# EAGLE design robot (EAGLE 6.5.0)
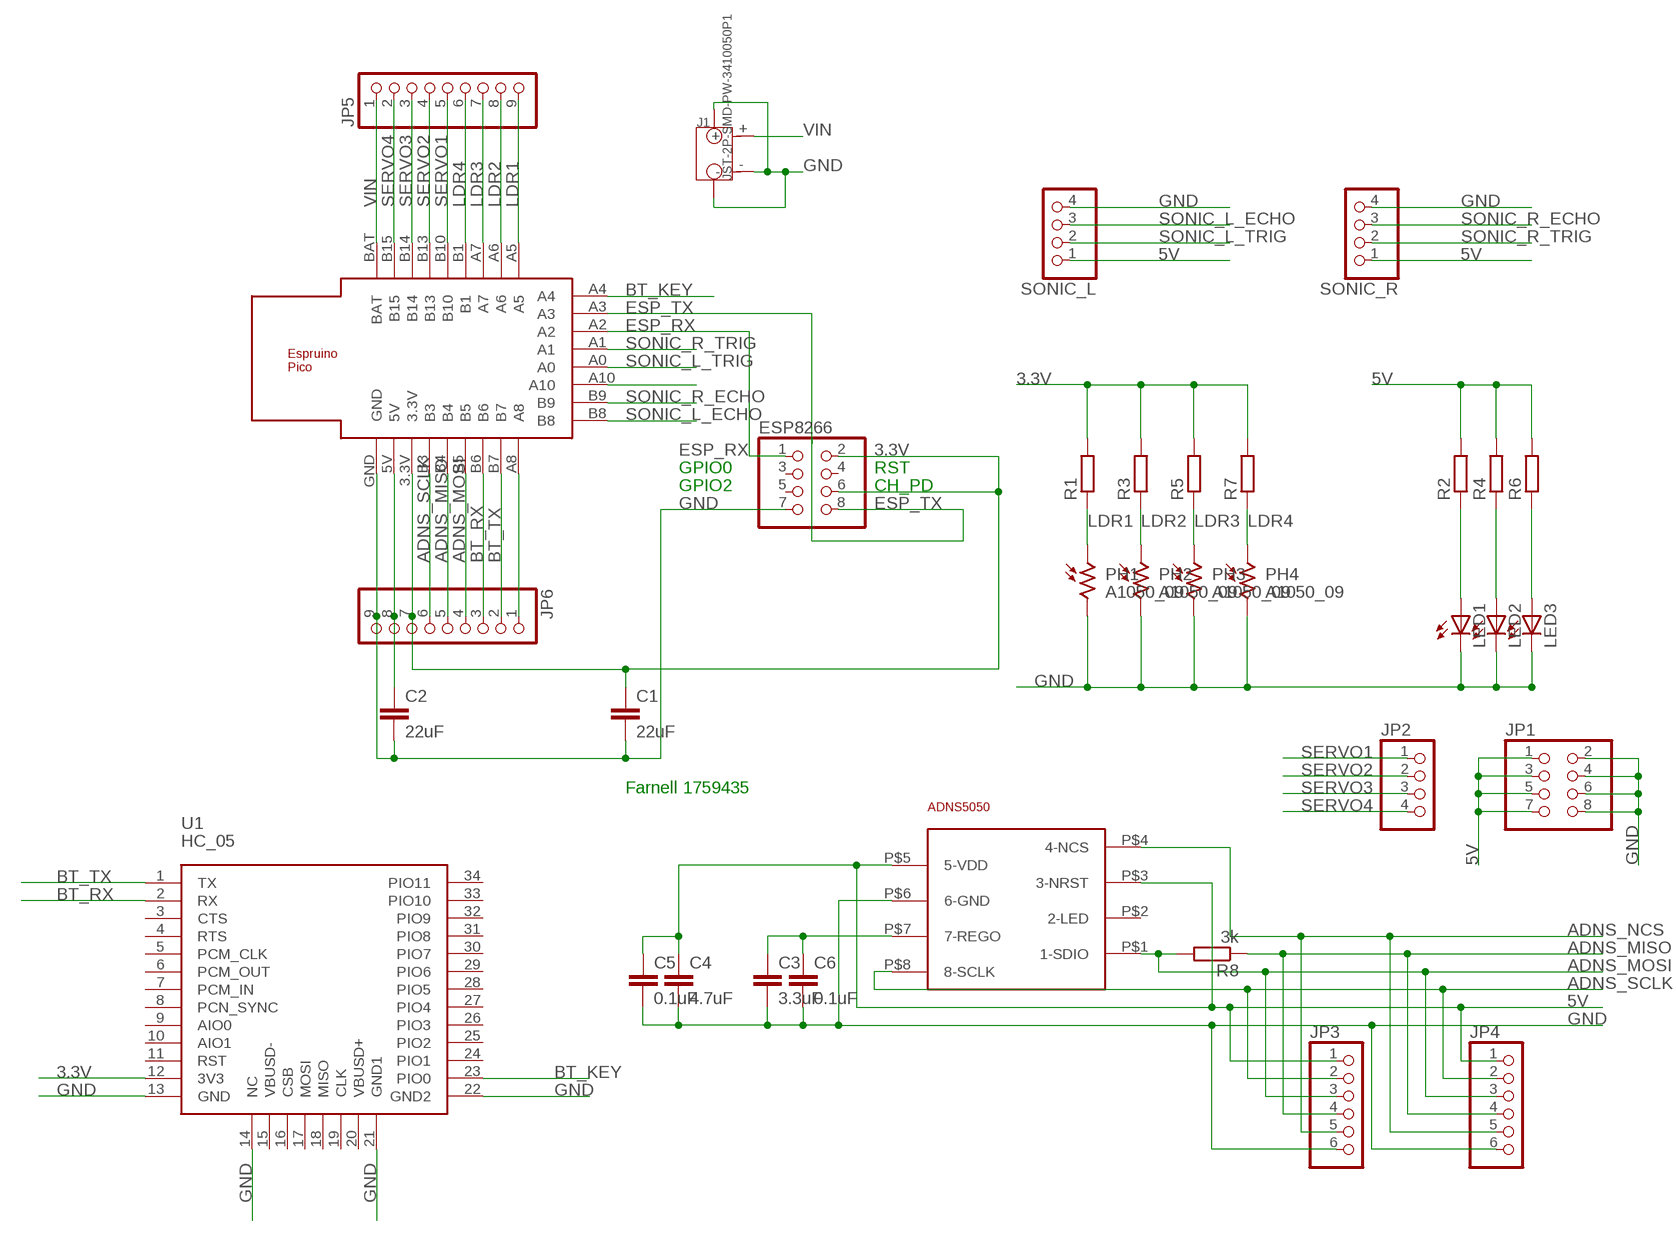
[diagram p0: schematic, sheet 1]

## Parts
C1  22uF  C-EUC1210  [C1210]
C2  22uF  C-EUC1210  [C1210]
C3  3.3uF  C-EUC1206  [C1206]
C4  4.7uF  C-EUC1206  [C1206]
C5  0.1uF  C-EUC1206  [C1206]
C6  0.1uF  C-EUC1206  [C1206]
ESP8266  PINHD-2X4  [2X04]
J1  JST-2P-SMD-PW-3410050P1  [2P-SMD-2.0-90D]
JP1  PINHD-2X4  [2X04]
JP2  PINHD-1X4  [1X04]
JP3  PINHD-1X6  [1X06]
JP4  PINHD-1X6  [1X06]
JP5  PINHD-1X9  [1X09]
JP6  PINHD-1X9  [1X09]
LED1  LED5MM  [LED5MM]
LED2  LED5MM  [LED5MM]
LED3  LED5MM  [LED5MM]
PH1  A1050_09  [T0-46-A10XX]
PH2  A1050_09  [T0-46-A10XX]
PH3  A1050_09  [T0-46-A10XX]
PH4  A1050_09  [T0-46-A10XX]
R1  R-EU_R1206  [R1206]
R2  R-EU_R1206  [R1206]
R3  R-EU_R1206  [R1206]
R4  R-EU_R1206  [R1206]
R5  R-EU_R1206  [R1206]
R6  R-EU_R1206  [R1206]
R7  R-EU_R1206  [R1206]
R8  3k  R-EU_R1206  [R1206]
SONIC_L  PINHD-1X4  [1X04]
SONIC_R  PINHD-1X4  [1X04]
U1  HC_05  [BLUETOOTH_SMD]
U$1  ESPRUINO_PICO_HALFSMD  [ESPRUINO_PICO_HALFSMD]
U$2  ADNS5050  [ADNS-5050]

## Nets
3.3V [power]: C1.1 ESP8266.2 ESP8266.6 JP6.7 R1.2 R3.2 R5.2 R7.2 U1.12(3V3) U$1.3.3V
5V [power]: C2.1 C4.1 C5.1 JP1.1 JP1.3 JP1.5 JP1.7 JP3.1 JP4.1 JP6.8 R2.2 R4.2 R6.2 SONIC_L.1 SONIC_R.1 U$1.5V U$2.P$3(3-NRST) U$2.P$5(5-VDD)
ADNS_MISO: JP3.4 JP4.4 JP6.5 R8.1 U$1.B4
ADNS_MOSI: JP3.3 JP4.3 JP6.4 R8.2 U$1.B5 U$2.P$1(1-SDIO)
ADNS_NCS: JP3.5 JP4.5 U$1.A10 U$2.P$4(4-NCS)
ADNS_SCLK: JP3.2 JP4.2 JP6.6 U$1.B3 U$2.P$8(8-SCLK)
BT_KEY: U1.23(PIO0) U$1.A4
BT_RX: JP6.3 U1.2(RX) U$1.B6
BT_TX: JP6.2 U1.1(TX) U$1.B7
ESP_RX: ESP8266.1 U$1.A2
ESP_TX: ESP8266.8 U$1.A3
GND [power]: C1.2 C2.2 C3.2 C4.2 C5.2 C6.2 ESP8266.7 J1.3 J1.4 J1.- JP1.2 JP1.4 JP1.6 JP1.8 JP3.6 JP4.6 JP6.9 LED1.K(C) LED2.K(C) LED3.K(C) PH1.2 PH2.2 PH3.2 PH4.2 SONIC_L.4 SONIC_R.4 U1.13(GND) U1.14(NC) U1.21(GND1) U1.22(GND2) U$1.GND U$2.P$6(6-GND)
LDR1: JP5.9 PH1.1 R1.1 U$1.A5
LDR2: JP5.8 PH2.1 R3.1 U$1.A6
LDR3: JP5.7 PH3.1 R5.1 U$1.A7
LDR4: JP5.6 PH4.1 R7.1 U$1.B1
N$1: JP6.1 U$1.A8
N$2: C3.1 C6.1 U$2.P$7(7-REGO)
N$5: LED3.A R6.1
N$7: LED2.A R4.1
N$9: LED1.A R2.1
SERVO1: JP2.1 JP5.5 U$1.B10
SERVO2: JP2.2 JP5.4 U$1.B13
SERVO3: JP2.3 JP5.3 U$1.B14
SERVO4: JP2.4 JP5.2 U$1.B15
SONIC_L_ECHO: SONIC_L.3 U$1.B8
SONIC_L_TRIG: SONIC_L.2 U$1.A0
SONIC_R_ECHO: SONIC_R.3 U$1.B9
SONIC_R_TRIG: SONIC_R.2 U$1.A1
VIN [power]: J1.+ JP5.1 U$1.BAT
Unconnected: ESP8266.3 ESP8266.4 ESP8266.5 U1.3(CTS) U1.4(RTS) U1.5(PCM_CLK) U1.6(PCM_OUT) U1.7(PCM_IN) U1.8(PCN_SYNC) U1.9(AIO0) U1.10(AIO1) U1.11(RST) U1.15(VBUSD-) U1.16(CSB) U1.17(MOSI) U1.18(MISO) U1.19(CLK) U1.20(VBUSD+) U1.24(PIO1) U1.25(PIO2) U1.26(PIO3) U1.27(PIO4) U1.28(PIO5) U1.29(PIO6) U1.30(PIO7) U1.31(PIO8) U1.32(PIO9) U1.33(PIO10) U1.34(PIO11) U$2.P$2(2-LED)

## Notes on the sheet
- GPIO0 | RST
- GPIO2 | CH_PD
- Farnell 1759435

## Library data of the parts
C1-C6 = rcl:C-EU: CAPACITOR, European symbol
ESP8266 JP1 = pinhead:PINHD-2X4: PIN HEADER
J1 = OPL5:JST-2P-SMD-PW
JP2 SONIC_L SONIC_R = pinhead:PINHD-1X4: PIN HEADER
JP3 JP4 = pinhead:PINHD-1X6: PIN HEADER
JP5 JP6 = pinhead:PINHD-1X9: PIN HEADER
LED1-LED3 = led:LED: LED OSRAM: - CHIPLED LG R971, LG N971, LY N971, LG Q971, LY Q971, LO R971, LY R971 LH N974, LH R974 LS Q976, LO Q976, LY Q976 LO Q996 - Hyper CHIPLED LW Q18S LB Q993, LB Q99A, LB R99A - SideLED LS A670, LO A670, LY A670, LG A670, LP A670 LB A673, LV A673, LT A673, LW A673 LH A674 LY A675 LS A676, LA A676, LO A676, LY A676, LW A676 LS A679, LY A679, LG A679 - Hyper Micro SIDELED® LS Y876, LA Y876, LO Y876, LY Y876 LT Y87S - SmartLED LW L88C, LW L88S LB L89C, LB L89S, LG L890 LS L89K, LO L89K, LY L89K LS L896, LA L896, LO L896, LY L896 - TOPLED LS T670, LO T670, LY T670, LG T670, LP T670 LSG T670, LSP T670, LSY T670, LOP T670, LYG T670 LG T671, LOG T671, LSG T671 LB T673, LV T673, LT T673, LW T673 LH T674 LS T676, LA T676, LO T676, LY T676, LB T676, LH T676, LSB T676, LW T676 LB T67C, LV T67C, LT T67C, LS T67K, LO T67K, LY T67K, LW E67C LS E67B, LA E67B, LO E67B, LY E67B, LB E67C, LV E67C, LT E67C LW T67C LS T679, LY T679, LG T679 LS T770, LO T770, LY T770, LG T770, LP T770 LB T773, LV T773, LT T773, LW T773 LH T774 LS E675, LA E675, LY E675, LS T675 LS T776, LA T776, LO T776, LY T776, LB T776 LHGB T686 LT T68C, LB T68C - Hyper Mini TOPLED® LB M676 - Mini TOPLED Santana® LG M470 LS M47K, LO M47K, LY M47K Source: http://www.osram.convergy.de LUXEON: - LUMILED® LXK2-PW12-R00, LXK2-PW12-S00, LXK2-PW14-U00, LXK2-PW14-V00 LXK2-PM12-R00, LXK2-PM12-S00, LXK2-PM14-U00 LXK2-PE12-Q00, LXK2-PE12-R00, LXK2-PE12-S00, LXK2-PE14-T00, LXK2-PE14-U00 LXK2-PB12-K00, LXK2-PB12-L00, LXK2-PB12-M00, LXK2-PB14-N00, LXK2-PB14-P00, LXK2-PB14-Q00 LXK2-PR12-L00, LXK2-PR12-M00, LXK2-PR14-Q00, LXK2-PR14-R00 LXK2-PD12-Q00, LXK2-PD12-R00, LXK2-PD12-S00 LXK2-PH12-R00, LXK2-PH12-S00 LXK2-PL12-P00, LXK2-PL12-Q00, LXK2-PL12-R00 Source: www.luxeon.com KINGBRIGHT: KA-3528ASYC Source: www.kingbright.com
PH1-PH4 = photo-elements:A10: Sensor Robust Light Sensing Applications Outdoor Light Sensing Application Source: http://optoelectronics.perkinelmer.com/content/Datasheets/DTS_PhotocellsA1050.pdf
R1-R8 = rcl:R-EU_: RESISTOR, European symbol
U1 = bluetooth:HC_05
U$1 = espruino_pico:ESPRUINO_PICO_HALFSMD
U$2 = adns5050:ADNS5050

## Net classes
0 default: width 0.305 mm
1 power: width 0.406 mm

## Board
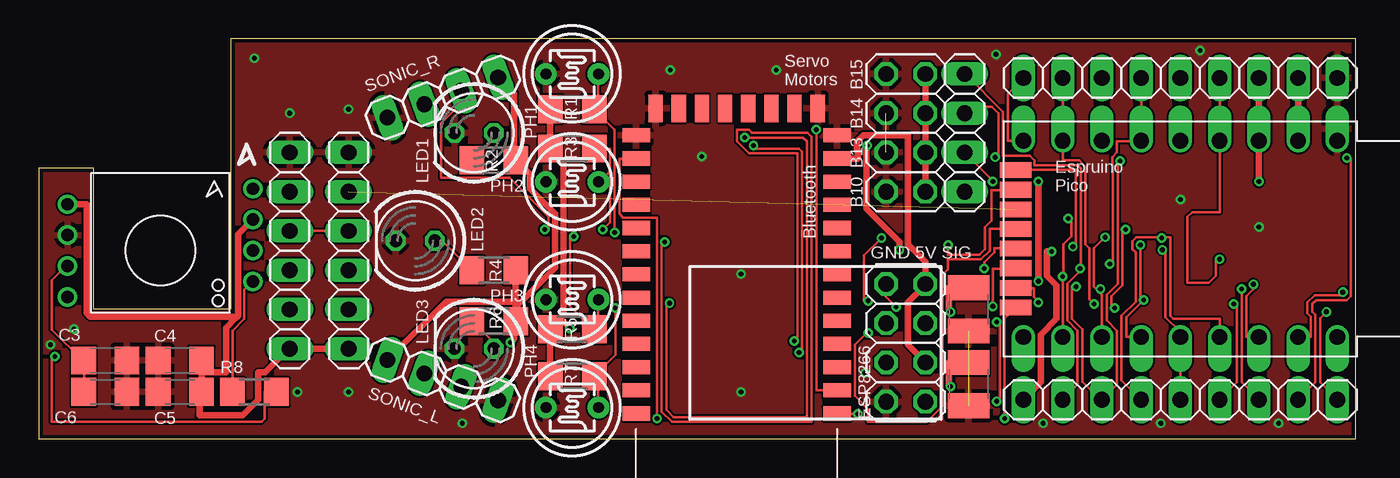
[diagram p1: board, top side]
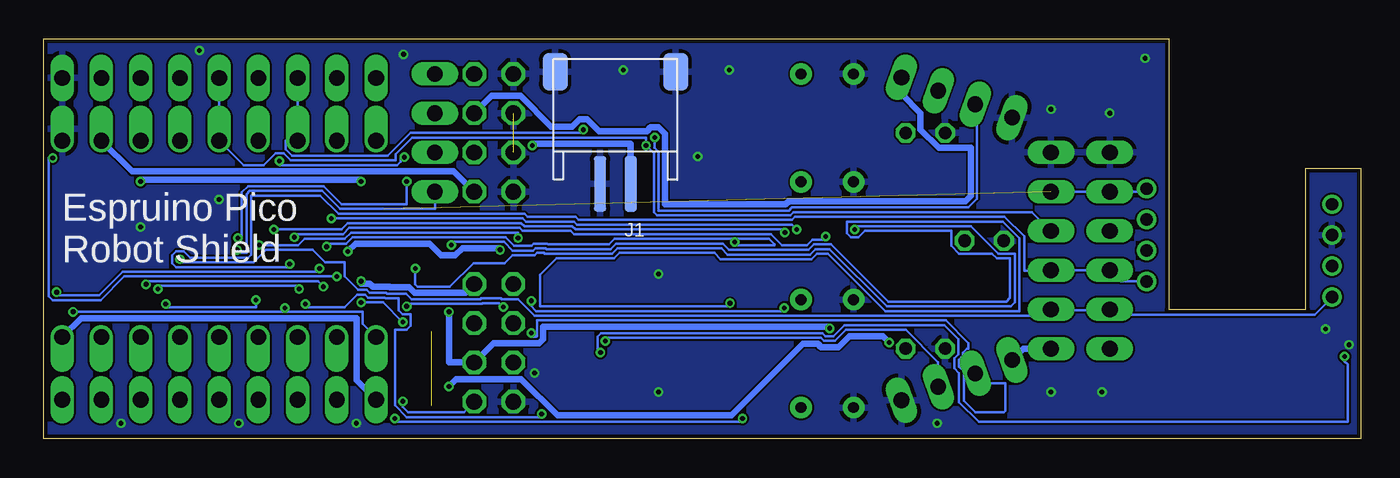
[diagram p2: board, bottom side, seen from below]

Size 85.27 x 25.91 mm. Coordinates in mm from the lower left corner, seen from the top.
Outline: 0,0 85.27,0 85.27,25.9 12.45,25.91 12.45,8.38 3.56,8.38 3.56,17.52 0,17.52 0,0
Copper layers (1*16): Top 0.035mm / dielectric 1.5mm / Bottom 0.035mm
Design rules "dirt_cheap_dirty_boards.v1 *": minimum track width 6mil, minimum drill 12mil, track to track 5mil, track to pad 5mil, pad to pad 5mil, via to via 5mil, smd to smd 0mil, copper to edge 10mil, drill to drill 10mil, minimum pad ring 9mil, minimum via ring 6mil, stop-mask expansion 2mil, vias tented up to drill 25mil, thermal gap 10mil

### Footprints (pad centres in the part's own frame; a part is rotated, then mirrored left to right if it is on the bottom)
C1210 = smd 1.6 x 2.7: 1 -1.4,0; 2 1.4,0
C1206 = smd 1.6 x 1.8: 1 -1.4,0; 2 1.4,0
2X04 = drill 1.016 octagon: 1 -3.81,-1.27; 2 -3.81,1.27; 3 -1.27,-1.27; 4 -1.27,1.27; 5 1.27,-1.27; 6 1.27,1.27; 7 3.81,-1.27; 8 3.81,1.27
2P-SMD-2.0-90D = smd 1.6 x 2.4: 3 3.9,-2.181; 4 -3.9,-2.181 | smd 0.8 x 3.6: + -1,5.08; - 1,5.08
1X04 = drill 1.016 long: 1 -3.81,0; 2 -1.27,0; 3 1.27,0; 4 3.81,0
1X06 = drill 1.016 long: 1 -6.35,0; 2 -3.81,0; 3 -1.27,0; 4 1.27,0; 5 3.81,0; 6 6.35,0
1X09 = drill 1.016 long: 1 -10.16,0; 2 -7.62,0; 3 -5.08,0; 4 -2.54,0; 5 0,0; 6 2.54,0; 7 5.08,0; 8 7.62,0; 9 10.16,0
LED5MM = drill 0.813 octagon: A -1.27,0; K 1.27,0
T0-46-A10XX = drill 0.7 pad 1.4: 1 -1.7,0; 2 1.7,0
R1206 = smd 1.6 x 1.803: 1 -1.422,0; 2 1.422,0
BLUETOOTH_SMD = smd 1.778 x 0.914: 1 0,0; 2 0,-1.5; 3 0,-3; 4 0,-4.5; 5 0,-6; 6 0,-7.5; 7 0,-9; 8 0,-10.5; 9 0,-12; 10 0,-13.5; 11 0,-15; 12 0,-16.5; 13 0,-18; 22 13,-18; 23 13,-16.5; 24 13,-15; 25 13,-13.5; 26 13,-12; 27 13,-10.5; 28 13,-9; 29 13,-7.5; 30 13,-6; 31 13,-4.5; 32 13,-3; 33 13,-1.5; 34 13,0 | smd 0.914 x 1.778: 14 1.25,-19.75; 15 2.75,-19.75; 16 4.25,-19.75; 17 5.75,-19.75; 18 7.25,-19.75; 19 8.75,-19.75; 20 10.25,-19.75; 21 11.75,-19.75
ESPRUINO_PICO_HALFSMD = drill 1.016 offset: 3.3V -7.62,-6.35; 5V -10.16,-6.35; A5 7.62,6.35; A6 5.08,6.35; A7 2.54,6.35; A8 7.62,-6.35; B1 0,6.35; B3 -5.08,-6.35; B4 -2.54,-6.35; B5 0,-6.35; B6 2.54,-6.35; B7 5.08,-6.35; B10 -2.54,6.35; B13 -5.08,6.35; B14 -7.62,6.35; B15 -10.16,6.35; BAT -12.7,6.35; GND -12.7,-6.35 | smd 2.032 x 1.016: A0 8.128,-0.635; A1 8.128,0.635; A2 8.128,1.905; A3 8.128,3.175; A4 8.128,4.445; A10 8.128,-1.905; B8 8.128,-4.445; B9 8.128,-3.175
ADNS-5050 = drill 0.8: P$1 6,-2; P$2 6,0; P$3 6,2; P$4 6,4; P$5 -6,3; P$6 -6,1; P$7 -6,-1; P$8 -6,-3

### Placement (x,y rotation side)
C1  60.2,8.38 270 top
C2  60.2,3.56 270 top
C3  4.32,5.08 0 top
C4  9.14,5.08 180 top
C5  9.14,3.05 180 top
C6  4.32,3.05 0 top
ESP8266  56.13,6.22 270 top
J1  48.26,21.59 180 bottom
JP1  56.13,19.81 90 top
JP2  59.94,19.81 90 top
JP3  16.26,12.19 90 top
JP4  20.07,12.19 90 top
JP5  73.91,2.54 0 top
JP6  73.91,23.37 0 top
LED1  28.19,19.81 180 top
LED2  24.38,12.83 180 top
LED3  28.19,5.84 180 top
PH1  34.54,23.62 180 top
PH2  34.54,16.64 180 top
PH3  34.54,9.02 180 top
PH4  34.54,2.03 180 top
R1  34.54,21.34 180 top
R2  29.46,18.03 0 top
R3  34.54,18.8 180 top
R4  29.46,10.92 0 top
R5  34.54,7.11 180 top
R6  29.46,7.62 0 top
R7  34.54,4.06 180 top
R8  13.97,3.05 180 top
SONIC_L  26.16,3.81 340 top
SONIC_R  26.16,22.1 200 top
U1  51.69,1.65 180 top
U$1  71.37,12.95 180 top
U$2  7.87,12.19 0 top

### Tracks (layer width: path | path; a pad name or v marks a point on that pad's centre or on a via)
3.3V  (via drill 0.3)
  Top 0.406: JP6.7 U$1.3.3V v78.99,16.66 | U1.12 51.71,18.14 53.03,18.14 53.03,18.69 52.98,18.75 52.98,19.25 53.39,19.66 56.29,19.66 56.29,12.6 57.4,11.48 ESP8266.2 57.3,9.86 56.29,8.84 56.29,6.1 57.4,4.98 ESP8266.6 | v64.72,10.21 v64.72,16.66 | v59.03,8.23 58.93,8.33 58.93,9.8 60.2,9.8 C1.1 | R1.2 R3.2 | R3.2 | R1.2 | R5.2 R7.2 | R7.2 | R5.2 | R3.2 33.22,18.64 33.98,17.88 33.98,8.03 33.22,7.26 R5.2 | v34.39,7.16 33.88,7.67 R5.2
  Bottom 0.406: v78.99,16.66 78.99,16.76 64.82,16.76 v64.72,16.66 | v64.72,10.21 64.72,10.06 64.16,10.06 63.96,9.86 62.89,9.86 62.84,9.8 61.62,9.8 61.27,9.45 57.96,9.45 57.4,10.01 ESP8266.2 | v59.03,8.23 59.03,4.98 57.4,4.98 ESP8266.6 57.25,5.08 56.13,6.2 53.19,6.2 52.93,6.45 52.93,7.26 34.49,7.26 v34.39,7.16
5V  (via drill 0.3)
  Top 0.406: JP6.8 U$1.5V | JP1.1 JP1.3 JP1.5 JP1.7 | JP4.1 JP3.1 16.1,5.74 14.68,4.32 14.22,4.32 14.22,2.54 13.21,1.52 10.41,1.52 10.41,2.9 C5.1 10.57,3.05 10.57,5.08 C4.1 10.72,4.32 12.14,4.32 12.14,7.21 12.72,7.8 | 12.72,7.8 12.9,7.98 12.9,13.26 13.87,14.22 U$2.P$3 | U$2.P$5 3.1,15.19 3.1,8.18 3.35,7.92 12.6,7.92 12.72,7.8 | R4.2 30.89,8.89 | 30.89,8.89 30.89,8.69 | 30.89,8.69 R6.2 | R6.2 | R4.2 | R2.2 31.8,17.12 31.8,16.2 33.43,14.58 33.43,11.07 31.04,8.69 30.89,8.69 | R2.2 | v59.03,3.4 58.93,3.5 58.93,4.98 60.2,4.98 C2.1 | v30.53,6.25 30.79,6.5 30.79,7.47 R6.2 | SONIC_R.1 29.77,23.37 30.79,22.35 30.79,18.19 R2.2 | 30.89,8.89 26.36,8.89 22.61,5.13 SONIC_L.1
  Bottom 0.406: U$1.5V 79.55,17.32 58.73,17.32 JP1.1 | JP4.1 21.84,5.84 22.55,5.13 SONIC_L.1 | v59.03,3.4 58.57,3.86 54.36,3.86 52.02,1.52 40.74,1.52 36.12,6.15 35.15,6.15 34.95,5.94 33.83,5.94 33.12,6.66 30.94,6.66 v30.53,6.25 | JP1.5 56.29,22.2 54.41,22.2 52.43,20.22 51.05,20.22 50.6,20.68 50.09,20.68 49.33,19.91 46.23,19.91 45.97,20.17 45.47,20.17 45.06,19.76 45.06,15.19 37.24,15.19 37.03,15.39 25.6,15.39 25.25,15.75 25.25,18.85 27.33,18.85 28.5,20.02 28.5,21.08 29.72,22.3 29.72,23.37 SONIC_R.1
ADNS_MISO  (via drill 0.3)
  Top 0.152: JP4.4 JP3.4 | R8.1 14.63,3.05 14.63,1.32 14.43,1.12 0.86,1.12 0.86,5.13 v1.07,5.33 | v49.23,5.59 49.43,5.59 49.43,18.59 49.23,18.8 46.28,18.8 v46.28,19
  Bottom 0.152: v1.07,5.33 1.07,5.03 0.86,4.83 0.86,1.12 24.74,1.12 26.01,2.39 26.01,4.27 26.31,4.57 26.31,5.23 26.06,5.49 26.06,6.45 26.98,7.37 33.43,7.37 34.14,6.66 34.65,6.66 34.85,6.86 49.17,6.86 49.43,6.6 49.43,5.59 v49.23,5.59 | JP6.5 U$1.B4 72.34,17.73 71.02,17.73 70.26,18.49 69.75,18.49 69.29,18.03 62.48,18.03 62.48,18.44 61.42,19.51 46.28,19.51 v46.28,19 45.77,18.49 45.77,14.68 45.57,14.48 36.93,14.48 36.73,14.68 21.29,14.68 JP4.4
ADNS_MOSI  (via drill 0.3)
  Top 0.152: JP6.4 U$1.B5 71.32,19.25 69.8,19.25 69.8,18.54 69.49,18.24 69.49,17.73 69.55,17.68 69.55,11.53 v69.34,11.33 | R8.2 12.55,7.01 13.31,7.77 13.31,9.65 13.87,10.21 U$2.P$1 | R8.2
  Bottom 0.152: U$2.P$1 13.92,10.21 15.54,10.21 JP3.3 JP4.3 20.12,10.87 21.79,10.87 21.79,13.11 23.06,14.38 36.63,14.38 36.83,14.17 50.65,14.17 50.85,14.38 53.95,14.38 54.15,14.58 66.19,14.58 67.36,15.75 71.83,15.75 71.83,11.94 72.03,11.73 75.79,11.73 76.2,12.14 76.71,12.14 76.96,11.89 76.96,11.38 76.71,11.12 69.34,11.12 v69.34,11.33
ADNS_NCS  (1 unrouted)
  Bottom 0.152: U$2.P$4 13.92,16.15 14.07,16 JP3.5 JP4.5
ADNS_SCLK  (via drill 0.3)
  Top 0.152: v76.45,11.63 76.2,11.63 76.2,10.57 75.74,10.11 74.37,10.11 74.37,14.38 74.68,14.68 76.45,14.68 U$1.B3 JP6.6
  Bottom 0.152: U$2.P$8 1.88,9.14 3,8.03 15.9,8.03 JP3.2 16.31,8.33 20.02,8.33 JP4.2 20.47,7.98 53.49,7.98 54.56,9.04 55.63,9.04 55.68,9.09 56.95,9.09 57,9.04 61.47,9.04 61.82,9.4 63.04,9.4 63.09,9.45 64.16,9.45 64.36,9.65 64.92,9.65 65.79,10.52 65.79,11.43 67.06,11.43 67.87,12.24 70.87,12.24 71.68,11.43 76.25,11.43 v76.45,11.63
BT_KEY  (via drill 0.3)
  Top 0.152: v40.03,1.32 40.03,14.33 37.85,14.33 37.59,14.58 37.59,18.14 38.66,18.14 U1.23 | v62.53,1.32 62.53,7.77 63.25,8.48 U$1.A4
  Bottom 0.152: v40.03,1.32 40.03,1.12 62.33,1.12 v62.53,1.32
BT_RX  (via drill 0.3)
  Top 0.152: v50.34,20.02 50.34,3.15 51.66,3.15 U1.2
  Bottom 0.152: v50.34,20.02 50.34,19.81 61.52,19.81 62.99,18.34 69.19,18.34 69.6,18.75 69.6,19.3 U$1.B6 JP6.3
BT_TX  (via drill 0.3)
  Top 0.152: v53.03,1.63 51.71,1.63 U1.1 | v68.33,8.74 68.02,9.04 68.02,12.34 67.77,12.6 67.77,17.63 67.36,18.03 66.29,18.03 U$1.B7 JP6.2
  Bottom 0.152: v53.03,1.63 53.03,1.42 61.77,1.42 62.53,2.18 62.53,7.06 61.77,7.06 61.52,7.32 61.52,8.08 62.03,8.08 62.28,8.33 62.28,9.09 63.14,9.09 63.2,9.14 64.26,9.14 64.47,9.35 64.97,9.35 65.79,8.53 68.12,8.53 v68.33,8.74
ESP_RX  (via drill 0.3)
  Top 0.152: v61.77,8.59 61.77,11.02 63.25,11.02 U$1.A2 | v55.52,8.53 54.86,9.2 ESP8266.1
  Bottom 0.152: v61.77,8.59 61.62,8.74 56.9,8.74 56.84,8.79 55.78,8.79 v55.52,8.53
ESP_TX  (via drill 0.3)
  Top 0.152: v64.72,8.84 64.72,8.89 64.41,9.2 64.41,9.75 63.25,9.75 U$1.A3 | v62.03,7.57 62.23,7.57 62.23,2.64 v62.03,2.44
  Bottom 0.152: v64.72,8.84 63.3,8.84 v62.03,7.57 | v62.03,2.44 62.03,2.08 61.67,1.73 58.06,1.73 57.4,2.39 ESP8266.8
GND  (via drill 0.3)  (2 unrouted)
  other vias: 2.29,7.11 0.76,6.1 16.76,3.05 20.07,3.05 20.07,21.34 16.26,21.08 45.47,3.05 45.47,10.67 42.93,18.29 40.89,23.88 78.99,13.72 73.91,15.49 53.49,4.27 61.98,24.89 75.18,25.15 80.26,1.02 72.64,1.02 65.02,1.02 27.43,1.02 13.97,24.64 47.75,23.88
  pour Top: 0,25.91 85.34,25.91 85.6,0 0.25,0
  pour Bottom: 0.25,0 85.6,0 85.34,25.91 0,25.91
LDR1  (via drill 0.3)
  Top 0.152: R1.1 36.22,21.59 36.22,23.62 PH1.1 | R1.1 | v83.36,8.23 82.96,7.82 82.96,3.66 JP5.9 | v37.29,13.36 37.29,20.02 36.02,21.29 R1.1 | v70.36,13.56 70.16,13.56 70.16,9.96 69.44,9.25 69.44,8.69 v69.65,8.48
  Bottom 0.152: U$1.A5 64.62,7.47 64.62,8.23 69.65,8.23 | v83.36,8.23 69.65,8.23 | v37.29,13.36 37.29,13.56 50.85,13.56 51.05,13.77 54.15,13.77 54.36,13.97 65.58,13.97 65.99,13.56 v70.36,13.56 | 69.65,8.23 v69.65,8.48
LDR2  (via drill 0.3)
  Top 0.152: R3.1 36.98,18.8 36.98,17.32 36.88,17.22 | 36.88,17.22 36.27,16.61 PH2.1 | U$1.A6 v66.29,10.52 66.34,10.57 66.34,12.6 66.85,13.11 66.85,14.28 v66.65,14.28 | v84.68,18.19 84.94,18.19 84.94,9.25 84.68,8.99 82.7,8.99 82.45,8.74 82.45,8.23 82.65,8.03 82.65,3.66 JP5.8 | v36.52,13.56 36.98,14.02 36.98,17.17 36.93,17.17 36.88,17.22
  Bottom 0.152: v66.29,10.52 80.06,10.52 81.58,8.99 84.68,8.99 84.94,9.25 84.94,18.19 v84.68,18.19 | v36.52,13.56 36.83,13.87 50.75,13.87 50.95,14.07 54.05,14.07 54.25,14.28 v66.65,14.28
LDR3  (via drill 0.3)
  Top 0.152: R5.1 36.22,7.37 36.22,8.99 PH3.1 | R5.1 | U$1.A7 68.83,9.35 68.63,9.55 | 68.63,9.55 68.33,9.86 68.33,12.34 v69.04,13.06 | v34.65,13.11 34.39,13.11 34.39,8.59 35.92,7.06 R5.1 | JP5.7 77.88,3.66 v77.88,9.7 | v68.73,9.7 68.68,9.65 68.68,9.6 68.63,9.55
  Bottom 0.152: v69.04,13.06 69.04,13.26 65.89,13.26 65.48,13.66 54.46,13.66 54.25,13.46 51.16,13.46 50.95,13.26 38.2,13.26 37.49,12.55 35.87,12.55 35.51,12.9 34.85,12.9 v34.65,13.11 | v77.88,9.7 77.88,9.91 68.94,9.91 v68.73,9.7
LDR4  (via drill 0.3)
  Top 0.152: R7.1 36.22,3.81 36.22,2.03 PH4.1 | R7.1 | U$1.B1 70.41,6.6 70.41,7.87 v71.53,8.99 71.32,8.89 v71.32,12.55 | v77.37,8.74 77.57,8.74 77.57,3.66 JP5.6 | v37.34,8.48 37.34,5.44 36.02,4.12 R7.1 | v53.7,8.94 53.44,8.94 53.44,11.89 v54.56,13.01
  Bottom 0.152: v71.53,8.99 71.53,8.53 77.17,8.53 v77.37,8.74 | v37.34,8.48 37.34,8.28 53.39,8.28 53.8,8.69 53.8,8.94 v53.7,8.94 | v54.56,13.01 54.56,13.36 65.38,13.36 65.79,12.95 68.38,12.95 68.78,12.55 v71.32,12.55
N$1
  Top 0.152: U$1.A8 62.74,19.3 62.74,22.35 JP6.1
N$2
  Top 0.152: C6.1 2.95,3.05 2.95,5.08 C3.1 2.85,5.08 0.86,7.06 0.86,10.26 1.83,11.23 U$2.P$7
N$5
  Top 0.152: LED3.A 29.46,6.25 28.09,7.62 R6.1
N$7
  Top 0.152: R4.1 26.16,12.8 25.65,12.8 LED2.A | R4.1
N$9
  Top 0.152: LED1.A 29.46,19.41 28.09,18.03 R2.1
SERVO1  (via drill 0.3)
  Top 0.152: JP5.5 U$1.B10 73.86,6.66 73.86,6.96 72.95,7.87 72.95,12.24 v72.75,12.24
  Bottom 0.152: JP2.1 59.94,14.88 66.09,14.88 67.26,16.05 71.93,16.05 72.14,15.85 72.14,12.04 72.54,12.04 v72.75,12.24
SERVO2  (via drill 0.3)
  Top 0.152: JP5.4 70.1,3.81 70.1,7.98 71.02,8.89 71.02,12.09 70.81,12.29 70.81,12.8 71.07,13.06 72.69,13.06 | 72.69,13.06 73.25,13.06 73.25,7.98 73.46,7.77 76.45,7.77 U$1.B13 | JP2.2 61.77,16.71 v61.77,16.66 | v72.69,13.01 72.69,13.06
  Bottom 0.152: v61.77,16.66 61.77,15.19 65.99,15.19 67.16,16.36 72.03,16.36 72.44,15.95 72.44,13.01 v72.69,13.01
SERVO3  (via drill 0.3)
  Top 0.152: v70,17.98 69.85,17.83 69.85,10.06 69.14,9.35 69.14,7.67 69.8,7.01 69.8,3.5 JP5.3 68.78,2.49 67.56,3.71 67.56,7.11 66.9,7.77 66.9,9.86 v67.16,9.86 | v61.92,18.24 62.13,18.44 62.13,21.08 61.72,21.49 59.94,21.49 JP2.3 | U$1.B14 78.18,6.6 78.18,9.25 78.64,9.7 v78.64,10.01
  Bottom 0.152: v70,17.98 70,17.73 62.38,17.73 62.18,17.93 62.18,18.24 v61.92,18.24 | v78.64,10.01 78.64,10.21 67.51,10.21 v67.16,9.86
SERVO4  (via drill 0.3)
  Top 0.152: JP5.2 67.26,3.5 67.26,7.01 66.6,7.67 66.6,10.06 67.46,10.92 67.46,11.02 | 67.46,11.02 67.46,17.53 67.26,17.73 64.47,17.73 64.47,18.03 64.16,18.34 62.43,18.34 62.43,21.18 59.99,23.62 JP2.4 | U$1.B15 82.35,6.6 82.35,7.92 82.14,8.13 82.14,8.84 82.6,9.3 84.43,9.3 v84.43,9.5 | v67.41,11.02 67.46,11.02
  Bottom 0.152: v84.43,9.5 84.43,9.3 81.69,9.3 80.16,10.82 67.61,10.82 v67.41,11.02
SONIC_L_ECHO  (via drill 0.3)
  Top 0.152: v66.95,12.45 67.16,12.65 67.16,17.42 63.25,17.42 U$1.B8 | v40.54,12.75 40.34,12.75 40.34,1.78 41,1.12 50.04,1.12 50.04,19.56 49.78,19.81 46.18,19.81 45.97,20.02 45.21,20.02 45.21,19.25 45.97,18.49 49.12,18.49 49.12,6.55 v48.92,6.35
  Bottom 0.152: v66.95,12.45 66.95,12.65 65.68,12.65 65.28,13.06 55.37,13.06 54.81,12.5 53.7,12.5 53.54,12.65 52.68,12.65 52.63,12.6 48.67,12.6 48.31,12.95 38.3,12.95 37.95,12.6 37.95,12.55 40.34,12.55 v40.54,12.75 | v48.92,6.35 48.92,6.55 34.95,6.55 34.75,6.35 34.04,6.35 33.33,7.06 29.46,7.06 27.38,4.98 27.38,3.4 SONIC_L.3
SONIC_L_TRIG  (via drill 0.3)
  Top 0.152: v53.7,6.86 53.59,6.86 52.83,6.1 52.83,2.79 53.7,1.93 53.7,1.12 57.51,1.12 58.52,2.13 58.52,9.6 58.47,9.65 58.47,9.75 58.52,9.8 58.52,10.62 58.88,10.97 58.88,11.63 61.01,11.63 61.57,12.19 61.57,13.61 63.25,13.61 U$1.A0
  Bottom 0.152: v53.7,6.86 53.7,6.6 53.39,6.6 53.34,6.66 53.34,7.67 26.87,7.67 25.4,6.2 25.4,5.84 25.5,5.84 25.76,5.59 25.76,5.28 25.86,5.28 26.01,5.13 26.01,4.67 25.7,4.37 25.7,2.49 24.94,1.73 23.11,1.73 23.01,1.83 23.01,3.61 24.33,3.61 24.94,4.22 SONIC_L.2
SONIC_R_ECHO  (via drill 0.3)
  Top 0.152: v58.88,12.55 58.88,11.94 60.91,11.94 61.27,12.29 61.27,13.72 61.67,14.12 61.67,16.1 63.25,16.1 U$1.B9 | v40.84,8.79 40.64,8.79 40.64,1.88 41.1,1.42 49.73,1.42 49.73,19.25 49.48,19.51 v45.72,19.51
  Bottom 0.152: v58.88,12.55 58.88,12.75 55.47,12.75 54.91,12.19 53.59,12.19 53.44,12.34 52.78,12.34 52.73,12.29 48.56,12.29 48.21,12.65 41.3,12.65 40.89,12.24 35.76,12.24 35.41,12.6 34.29,12.6 30.58,8.89 22.96,8.89 22.71,9.14 22.71,11.68 23.57,11.68 23.88,11.99 26.01,11.99 26.52,12.5 26.52,13.46 32.11,13.46 32.51,13.06 33.02,13.06 33.27,13.31 33.27,14.07 23.16,14.07 22.1,13.01 22.1,8.28 30.79,8.28 34.49,11.99 35.2,11.99 35.56,11.63 41.45,11.63 41.86,12.04 48.01,12.04 48.36,11.68 52.07,11.68 53.14,10.62 53.14,8.59 41.05,8.59 v40.84,8.79 | v45.72,19.51 45.72,18.85 45.47,18.59 45.47,14.78 37.03,14.78 36.83,14.99 25.4,14.99 24.84,15.54 24.84,21.64 24.94,21.64 SONIC_R.3
SONIC_R_TRIG  (via drill 0.3)
  Top 0.152: v61.21,11.02 61.21,11.43 61.87,12.09 61.87,12.34 63.25,12.34 U$1.A1 | v32.77,13.56 33.02,13.56 33.02,14.38 30.48,16.92 26.06,16.92 26.06,20.42 27.33,21.69 27.33,22.5 SONIC_R.2
  Bottom 0.152: v61.21,11.02 61.21,10.01 61.06,9.86 58.98,9.86 57.45,11.38 55.42,11.38 54.91,11.89 53.49,11.89 53.34,12.04 52.88,12.04 52.83,11.99 48.46,11.99 48.11,12.34 41.4,12.34 41,11.94 35.66,11.94 35.31,12.29 34.39,12.29 30.68,8.59 22.66,8.59 22.4,8.84 22.4,11.99 23.47,11.99 25.25,13.77 32.56,13.77 v32.77,13.56
VIN  (via drill 0.3)
  Top 0.406: v53.65,19 53.59,18.95 53.59,14.88 55.73,12.75 v55.73,12.24 | v65.58,12.14 65.28,12.14 65.28,10.57 65.89,9.96 65.89,7.77 64.87,6.76 64.87,3.66 JP5.1
  Bottom 0.406: JP5.1 65.02,3.81 65.02,7.82 82.86,7.82 U$1.BAT | v53.65,19 53.54,19.1 47.3,19.1 47.3,16.51 J1.+ | v55.73,12.24 55.73,12.34 58.17,12.34 58.62,11.89 59.54,11.89 60.3,12.65 65.08,12.65 v65.58,12.14

### Text on the board
tNames: Servo / Motors | B15 | B14 | B13 | Espruino / Pico | B10 | Bluetooth | GND 5V SIG | ESP8266
bNames: Espruino Pico / Robot Shield